# EAGLE design eeZeePower (EAGLE 6.3)
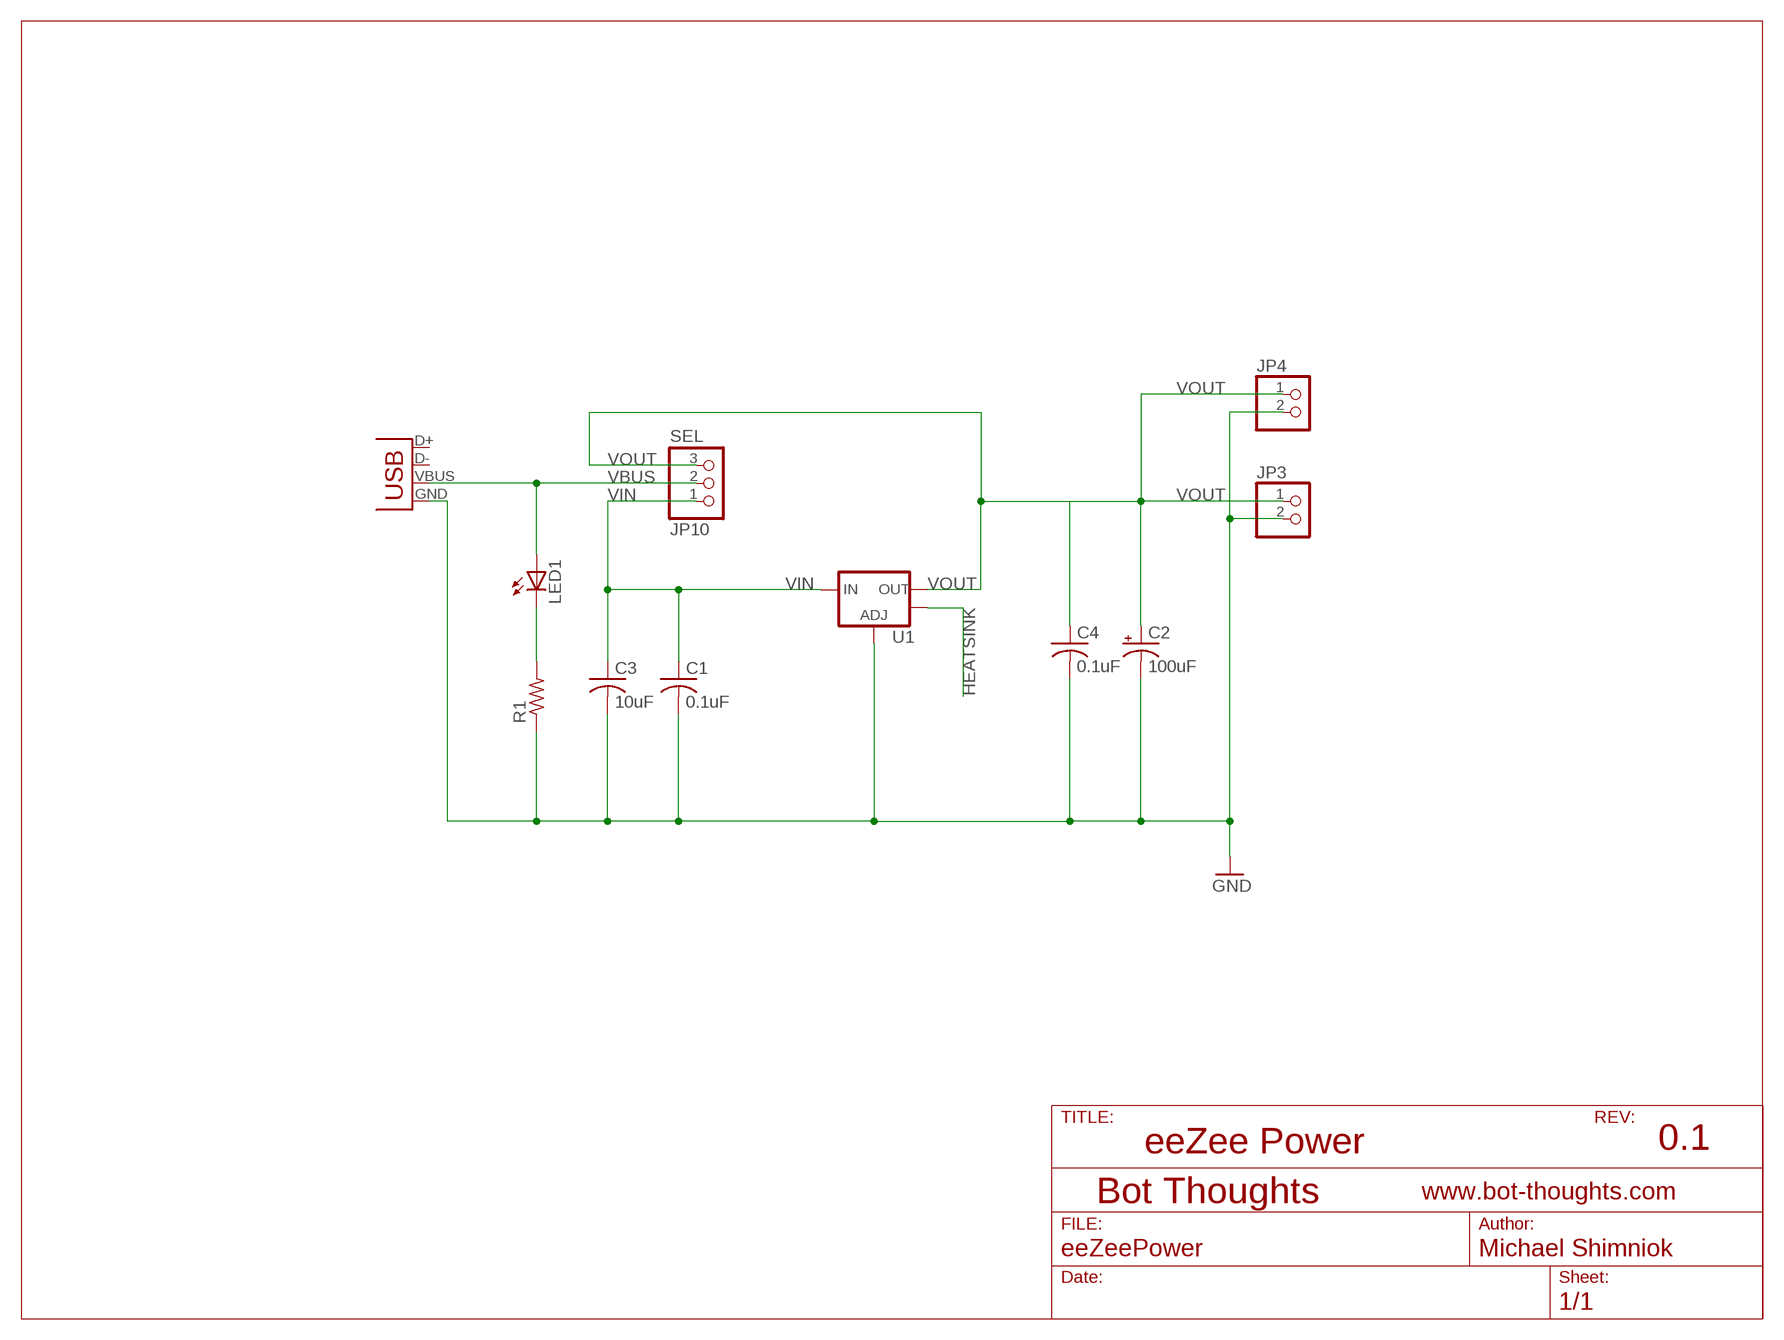
[diagram p0: schematic, sheet 1]

## Parts
C1  0.1uF  C-USC0603  [C0603]
C2  100uF  CPOL-USSMCB  [SMC_B]
C3  10uF  C-USC0603  [C0603]
C4  0.1uF  C-USC0603  [C0603]
JP1  USBSMD  [USB-MINIB]
JP3  PINHD-1X02_2.54-S  [1X02-S]
JP4  PINHD-1X02_2.54-S  [1X02-S]
JP10  SEL  PINHD-1X03_2.54-S  [1X03-S]
LED1  LEDCHIPLED_0805  [CHIPLED_0805]
R1  R-US_R0603  [R0603]
U1  V_REG_LM1117SOT223  [SOT223]

## Nets
GND: C1.2 C2.- C3.2 C4.2 JP1.GND JP3.2 JP4.2 R1.1 U1.1(ADJ)
HEATSINK: U1.4(OUT)
N$5: LED1.C R1.2
VBUS: JP1.VBUS JP10.2 LED1.A
VIN: C1.1 C3.1 JP10.1 U1.3(IN)
VOUT: C2.+ C4.1 JP3.1 JP4.1 JP10.3 U1.2(OUT)
Unconnected: JP1.D+ JP1.D-

## Notes on the sheet
- eeZee Power | 0.1

## Library data of the parts
C1 C3 C4 = rcl:C-US: CAPACITOR, American symbol
C2 = rcl:CPOL-US: POLARIZED CAPACITOR, American symbol
JP1 = SparkFun:USB: USB Connectors USB-B-PTH is fully proven SKU : PRT-00139 USB-miniB is fully proven SKU : PRT-00587 USB-A-PCB is untested. USB-A-H is throughly reviewed, but untested. Spark Fun Electronics SKU : PRT-00437 USB-B-SMT is throughly reviewed, but untested. Needs silkscreen touching up. USB-A-S has not been used/tested USB-MB-H has not been used/tested
JP3 JP4 = pinhead-2:PINHD-1X02: PIN HEADER
JP10 = pinhead-2:PINHD-1X03: PIN HEADER
LED1 = led:LED: LED OSRAM: - CHIPLED LG R971, LG N971, LY N971, LG Q971, LY Q971, LO R971, LY R971 LH N974, LH R974 LS Q976, LO Q976, LY Q976 LO Q996 - Hyper CHIPLED LW Q18S LB Q993, LB Q99A, LB R99A - SideLED LS A670, LO A670, LY A670, LG A670, LP A670 LB A673, LV A673, LT A673, LW A673 LH A674 LY A675 LS A676, LA A676, LO A676, LY A676, LW A676 LS A679, LY A679, LG A679 - Hyper Micro SIDELED® LS Y876, LA Y876, LO Y876, LY Y876 LT Y87S - SmartLED LW L88C, LW L88S LB L89C, LB L89S, LG L890 LS L89K, LO L89K, LY L89K LS L896, LA L896, LO L896, LY L896 - TOPLED LS T670, LO T670, LY T670, LG T670, LP T670 LSG T670, LSP T670, LSY T670, LOP T670, LYG T670 LG T671, LOG T671, LSG T671 LB T673, LV T673, LT T673, LW T673 LH T674 LS T676, LA T676, LO T676, LY T676, LB T676, LH T676, LSB T676, LW T676 LB T67C, LV T67C, LT T67C, LS T67K, LO T67K, LY T67K, LW E67C LS E67B, LA E67B, LO E67B, LY E67B, LB E67C, LV E67C, LT E67C LW T67C LS T679, LY T679, LG T679 LS T770, LO T770, LY T770, LG T770, LP T770 LB T773, LV T773, LT T773, LW T773 LH T774 LS E675, LA E675, LY E675, LS T675 LS T776, LA T776, LO T776, LY T776, LB T776 LHGB T686 LT T68C, LB T68C - Hyper Mini TOPLED® LB M676 - Mini TOPLED Santana® LG M470 LS M47K, LO M47K, LY M47K Source: http://www.osram.convergy.de LUXEON: - LUMILED® LXK2-PW12-R00, LXK2-PW12-S00, LXK2-PW14-U00, LXK2-PW14-V00 LXK2-PM12-R00, LXK2-PM12-S00, LXK2-PM14-U00 LXK2-PE12-Q00, LXK2-PE12-R00, LXK2-PE12-S00, LXK2-PE14-T00, LXK2-PE14-U00 LXK2-PB12-K00, LXK2-PB12-L00, LXK2-PB12-M00, LXK2-PB14-N00, LXK2-PB14-P00, LXK2-PB14-Q00 LXK2-PR12-L00, LXK2-PR12-M00, LXK2-PR14-Q00, LXK2-PR14-R00 LXK2-PD12-Q00, LXK2-PD12-R00, LXK2-PD12-S00 LXK2-PH12-R00, LXK2-PH12-S00 LXK2-PL12-P00, LXK2-PL12-Q00, LXK2-PL12-R00 Source: www.luxeon.com KINGBRIGHT: KA-3528ASYC Source: www.kingbright.com
R1 = resistor:R-US_: RESISTOR, American symbol
U1 = SparkFun:V_REG_LM1117: Voltage Regulator LM1117 Standard adjustable voltage regulator but in SMD form. Spark Fun Electronics SKU : COM-00595

## Board
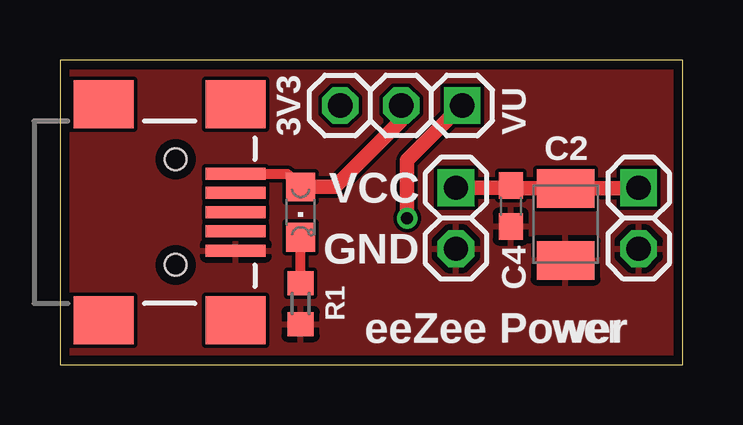
[diagram p1: board, top side]
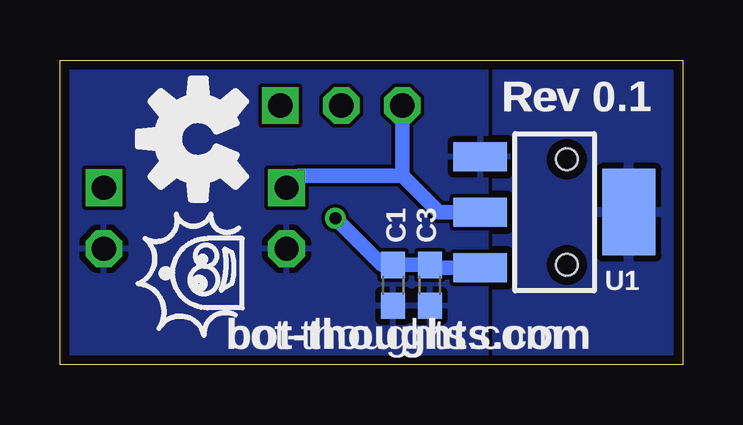
[diagram p2: board, bottom side, seen from below]

Size 25.96 x 12.69 mm. Coordinates in mm from the lower left corner, seen from the top.
Outline: 0,0 25.96,0 25.96,12.69 0,12.69 0,0
Copper layers (1*16): Top 0.0356mm / dielectric 1.5011mm / Bottom 0.0356mm
Design rules "LaenPCBOrder": minimum track width 6mil, minimum drill 13mil, track to track 6mil, track to pad 6mil, pad to pad 6mil, via to via 6mil, smd to smd 6mil, copper to edge 15mil, drill to drill 6mil, minimum pad ring 7mil, minimum via ring 7mil, stop-mask expansion 4mil, vias tented up to drill 0mil, thermal gap 10mil

### Footprints (pad centres in the part's own frame; a part is rotated, then mirrored left to right if it is on the bottom)
C0603 = smd 1.1 x 1: 1 -0.85,0; 2 0.85,0
SMC_B = smd 1.6 x 2.4: + -1.5,0; - 1.5,0
USB-MINIB = smd 2.5 x 0.5: D+ 2.5,0; D- 2.5,0.8; GND 2.5,-1.6; ID 2.5,-0.8; VBUS 2.5,1.6 | smd 2.5 x 2: MTN1 -3,4.5; MTN2 2.5,4.5; MTN3 -3,-4.5; MTN4 2.5,-4.5 | hole 0.9: 0,2.2; 0,-2.2
1X02-S = drill 1.016 square: 1 -1.27,0 | drill 1.016 octagon: 2 1.27,0
1X03-S = drill 1.016 square: 1 -2.54,0 | drill 1.016 octagon: 2 0,0; 3 2.54,0
CHIPLED_0805 = smd 1.2 x 1.2: A 0,-1.05; C 0,1.05
R0603 = smd 1 x 1.1: 1 -0.85,0; 2 0.85,0
SOT223 = smd 1.219 x 2.235: 1 -2.311,-3.099; 2 0,-3.099; 3 2.311,-3.099 | smd 3.6 x 2.2: 4 0,3.099

### Placement (x,y rotation side)
C1  12.06,3.3 270 bottom
C2  21.08,5.84 270 top
C3  10.54,3.3 270 bottom
C4  18.8,6.6 270 top
JP1  4.83,6.35 0 top
JP3  16.51,6.1 270 top
JP4  24.13,6.1 270 top
JP10  14.22,10.79 180 top
LED1  10.03,6.35 180 top
R1  10.03,2.54 90 top
U1  5.33,6.35 270 bottom

### Tracks (layer width: path | path; a pad name or v marks a point on that pad's centre or on a via)
GND
  pour Top (rank 3): 0,12.7 25.91,12.7 25.91,0 0,0
  pour Bottom (rank 2): 0,12.7 25.91,12.7 25.91,0 0,0
HEATSINK
  pour Bottom (isolate 0.305): 0.13,12.45 7.75,12.45 7.75,0.25 0.13,0.25
N$5
  Top 0.406: R1.2 LED1.C
VBUS
  Top 0.406: JP1.VBUS 9.48,7.95 LED1.A
  Top 0.61: LED1.A 11.46,7.4 14.22,10.16 JP10.2
VIN  (via drill 0.5)
  Top 0.61: v14.48,6.1 14.48,8.51 JP10.1
  Bottom 0.61: U1.3 10.43,4.04 C3.1 C1.1 12.53,4.15 v14.48,6.1
VOUT
  Top 0.61: JP4.1 24.11,7.34 C2.+ 18.91,7.34 C4.1 18.71,7.37 JP3.1
  Bottom 0.61: U1.2 10.16,6.35 11.68,7.87 | 11.68,7.87 JP10.3 | 11.68,7.87 16,7.87 JP3.1

### Text on the board
bPlace: Rev 0.1 | bot-thoughts.com
tNames: VU | 3V3 | VCC | GND | eeZee Power
tsilk: VU | 3V3 | C2 | VCC | GND | C4 | R1 | eeZee Power
bsilk: Rev 0.1 | C3 | C1 | U1 | bot-thoughts.com